# EAGLE schematic mydpi (EAGLE 9.5.2)
CHECKED_BY: -; DRAWN_BY: zaan; REV: 1.0; TITLE: myDPI
Assembly variants: BOM
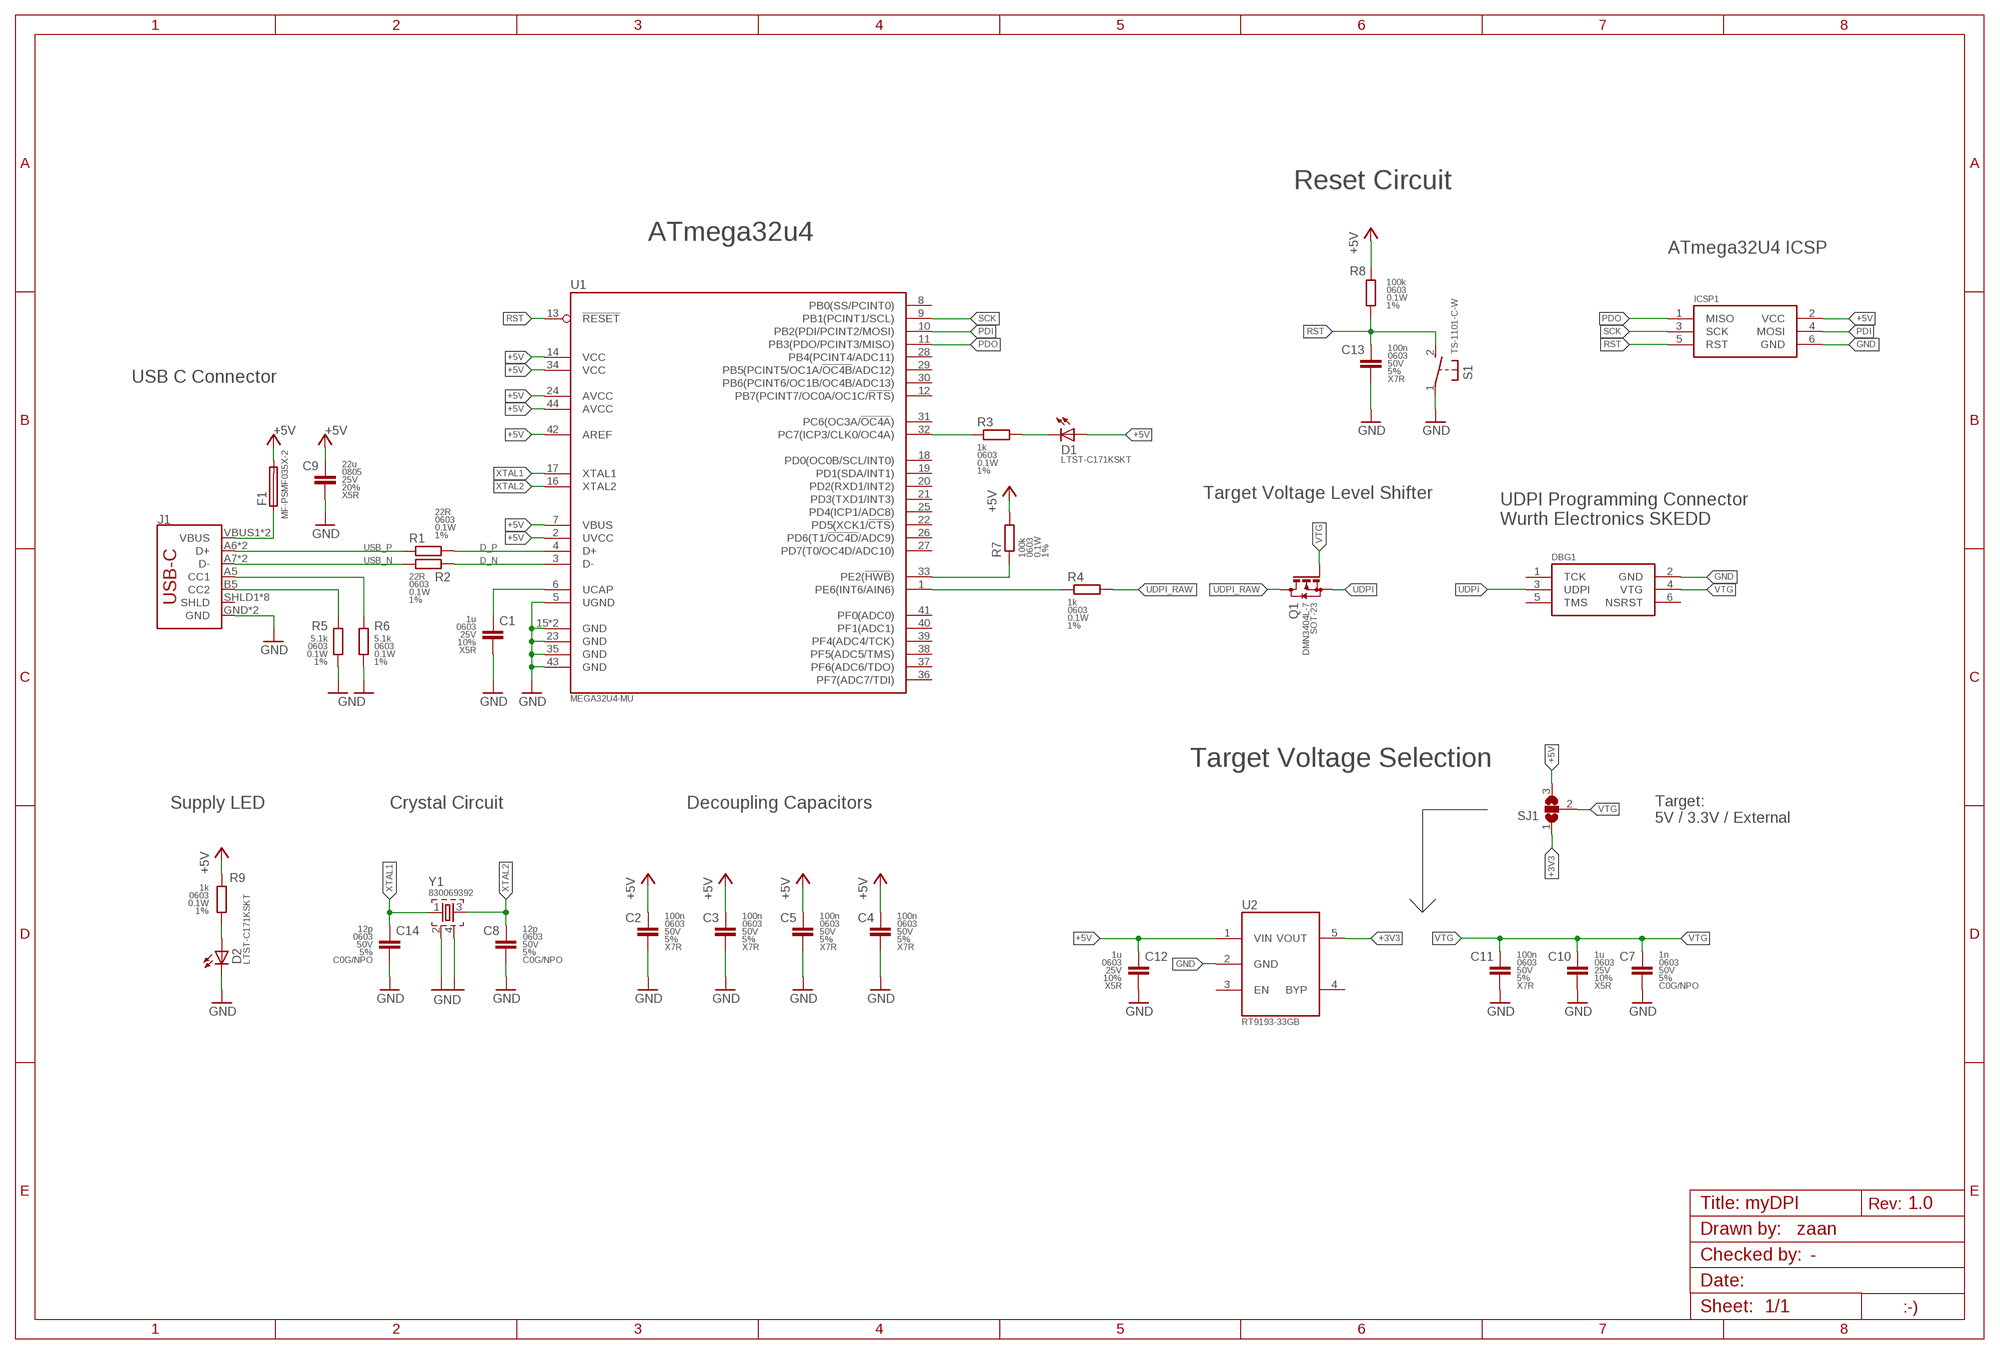
[diagram p0: schematic, sheet 1]

## Parts
C1  1u  1UF-0603-25V-10%  [C0603]
C2  100n  100NF-0603-50V-5%  [C0603]
C3  100n  100NF-0603-50V-5%  [C0603]
C4  100n  100NF-0603-50V-5%  [C0603]
C5  100n  100NF-0603-50V-5%  [C0603]
C7  1n  1NF-0603-50V-5%  [C0603]
C8  12p  12PF-0603-50V-5%  [C0603]
C9  22u  22UF-0805-25V-20%  [C0805]
C10  1u  1UF-0603-25V-10%  [C0603]
C11  100n  100NF-0603-50V-5%  [C0603]
C12  1u  1UF-0603-25V-10%  [C0603]
C13  100n  100NF-0603-50V-5%  [C0603]
C14  12p  12PF-0603-50V-5%  [C0603]
D1  LTST-C171KSKT  [CHIPLED_0805]
D2  LTST-C171KSKT  [CHIPLED_0805]
DBG1  AVR-UPDI-6-SKEDD  [490107670612_DEBUGGING]  (not fitted in variant BOM)
F1  MF-PSMF035X-2  [F0805]
ICSP1  AVR-ISP-SMD  [AVRISP-1.27-SMD]  (not fitted in variant BOM)
J1  USB_C2-LAYER  [USB-C-16P]
Q1  DMN3404L  [SOT23]
R1  22R  22OHM-0603-1/10W-1%  [R0603]
R2  22R  22OHM-0603-1/10W-1%  [R0603]
R3  1k  1KOHM-0603-1/10W-1%  [R0603]
R4  1k  1KOHM-0603-1/10W-1%  [R0603]
R5  5.1k  5.1KOHM-0603-1/10W-1%  [R0603]
R6  5.1k  5.1KOHM-0603-1/10W-1%  [R0603]
R7  100k  100KOHM-0603-1/10W-1%  [R0603]
R8  100k  100KOHM-0603-1/10W-1%  [R0603]
R9  1k  1KOHM-0603-1/10W-1%  [R0603]
S1  TS-1101-C-W  [SPST-6X3.6]
SJ1  SJ2W  [SJ_2]  (not fitted in variant BOM)
U1  MEGA32U4-MU  [TQFN44_7MM]
U2  RT9193-33GB  [SOT23-5]
Y1  830069392  [WE-XTAL_CFPX-218]

## Nets
+3V3: SJ1.1 U2.5(VOUT)
+5V: C2.1 C3.1 C4.1 C5.1 C9.1 C12.1 D1.A F1.2 ICSP1.2(VCC) R7.2 R8.2 R9.1 SJ1.3 U1.2(UVCC) U1.7(VBUS) U1.14(VCC) U1.24(AVCC) U1.34(VCC) U1.42(AREF) U1.44(AVCC) U2.1(VIN)
D_N [usb]: R2.2 U1.3(D-)
D_P [usb]: R1.2 U1.4(D+)
GND: C1.2 C2.2 C3.2 C4.2 C5.2 C7.2 C8.2 C9.2 C10.2 C11.2 C12.2 C13.2 C14.2 D2.C DBG1.2(GND) ICSP1.6(GND) J1.GND J1.GND2(GND) R5.1 R6.1 S1.1(P) U1.5(UGND) U1.15(GND) U1.23(GND) U1.35(GND) U1.43(GND) U1.EXP(GND) U2.2(GND) Y1.2 Y1.4
N$1: R3.1 U1.32(PC7(ICP3/CLK0/OC4A))
N$2: D1.C R3.2
N$5: J1.B5(CC2) R5.2
N$6: J1.A5(CC1) R6.2
N$7: R7.1 U1.33(PE2(!HWB!))
N$8: C1.1 U1.6(UCAP)
N$9: D2.A R9.2
N$12: F1.1 J1.VBUS1(VBUS) J1.VBUS2(VBUS)
PDI: ICSP1.4(MOSI) U1.10(PB2(PDI/PCINT2/MOSI))
PDO: ICSP1.1(MISO) U1.11(PB3(PDO/PCINT3/MISO))
PE6: R4.1 U1.1(PE6(INT6/AIN6))
RST: C13.1 ICSP1.5(RST) R8.1 S1.2(S) U1.13(!RESET!)
SCK: ICSP1.3(SCK) U1.9(PB1(PCINT1/SCL))
UDPI: DBG1.3(UDPI) Q1.2(S)
UDPI_RAW: Q1.3(D) R4.2
USB_N [usb]: J1.A7(D-) J1.B7(D-) R2.1
USB_P [usb]: J1.A6(D+) J1.B6(D+) R1.1
VTG: C7.1 C10.1 C11.1 DBG1.4(VTG) Q1.1(G) SJ1.2
XTAL1: C14.1 U1.17(XTAL1) Y1.1
XTAL2: C8.1 U1.16(XTAL2) Y1.3
Unconnected: DBG1.1(TCK) DBG1.5(TMS) DBG1.6(NSRST) J1.SHLD1(SHLD) J1.SHLD2(SHLD) J1.SHLD3(SHLD) J1.SHLD4(SHLD) J1.SHLD5(SHLD) J1.SHLD6(SHLD) J1.SHLD7(SHLD) J1.SHLD8(SHLD) U1.8(PB0(SS/PCINT0)) U1.12(PB7(PCINT7/OC0A/OC1C/!RTS!)) U1.18(PD0(OC0B/SCL/INT0)) U1.19(PD1(SDA/INT1)) U1.20(PD2(RXD1/INT2)) U1.21(PD3(TXD1/INT3)) U1.22(PD5(XCK1/!CTS!)) U1.25(PD4(ICP1/ADC8)) U1.26(PD6(T1/!OC4D!/ADC9)) U1.27(PD7(T0/OC4D/ADC10)) U1.28(PB4(PCINT4/ADC11)) U1.29(PB5(PCINT5/OC1A/!OC4B!/ADC12)) U1.30(PB6(PCINT6/OC1B/OC4B/ADC13)) U1.31(PC6(OC3A/!OC4A!)) U1.36(PF7(ADC7/TDI)) U1.37(PF6(ADC6/TDO)) U1.38(PF5(ADC5/TMS)) U1.39(PF4(ADC4/TCK)) U1.40(PF1(ADC1)) U1.41(PF0(ADC0)) U2.3(EN) U2.4(BYP)

## Notes on the sheet
- Reset Circuit
- ATmega32u4
- ATmega32U4 ICSP
- USB C Connector
- Target Voltage Level Shifter
- UDPI Programming Connector
  Wurth Electronics SKEDD
- Target Voltage Selection
- Supply LED | Crystal Circuit | Decoupling Capacitors
- Target:
  5V / 3.3V / External

## Library data of the parts
C1 C10 C12 = zaan-Capacitors:1UF: 1uF capacitor; DESCRIPTION: Surface Mount Capacitor; DIELECTRIC: X5R; MF: Yageo; MPN: CC0603KRX5R8BB105; PACKAGE: 1606; PACKAGE-IN: 0603; TOLERANCE: 10%; VOLTAGE: 25V
C2-C5 C11 C13 = zaan-Capacitors:100NF: 100nF capacitor; DESCRIPTION: Surface Mount Capacitor; DIELECTRIC: X7R; MF: Yageo; MPN: CC0603JRX7R9BB104; PACKAGE: 1606; PACKAGE-IN: 0603; TOLERANCE: 5%; VOLTAGE: 50V
C7 = zaan-Capacitors:1NF: 1nF capacitor; DESCRIPTION: Surface Mount Capacitor; DIELECTRIC: C0G/NPO; MF: Yageo; MPN: CC0603JRNPO9BN102; PACKAGE: 1608; PACKAGE-IN: 0603; TOLERANCE: 5%; VOLTAGE: 50V
C8 C14 = zaan-Capacitors:12PF: 12pF capacitor; DESCRIPTION: Surface Mount Capacitor; DIELECTRIC: C0G/NPO; MF: Yageo; MPN: CC0603JRNPO9BN120; PACKAGE: 1606; PACKAGE-IN: 0603; TOLERANCE: 5%; VOLTAGE: 50V
C9 = zaan-Capacitors:22UF: 22uF capacitor; DESCRIPTION: Surface Mount Capacitor; DIELECTRIC: X5R; MF: Murata; MPN: GRM21BR61E226ME44L; PACKAGE: 2012; PACKAGE-IN: 0805; TOLERANCE: 20%; VOLTAGE: 25V
D1 D2 = zaan-Optoelectronics:LTST: SMD LED Footprint: 0805 Source: Datasheet <http://optoelectronics.liteon.com/upload/download/ds22-2000-110/ltst-c171kskt.pdf> Manufacturer: Lite-On; DESCRIPTION: Surface Mount LED; MF: Lite-On; MPN: LTST-C171KSKT; PACKAGE: 2012; PACKAGE-IN: 0805
DBG1 = zaan-Connectors:AVR-UPDI-6
F1 = zaan-Fuses:MF-PSMF: PTC Resetable Fuse MF-PSMF Series - PTC Resettable Fuses Footprint: 0805 Source: Datasheet <https://www.bourns.com/data/global/pdfs/mfpsmf.pdf> Manufacturer: Bourns; DESCRIPTION: PTC Fuse; MF: Bourns; MPN: MF-PSMF035X-2; PACKAGE: 2012
ICSP1 = zaan-Connectors:AVR-ISP
J1 = zaan-Connectors:USB_C: USB Type C 16 Pin Connector Female 16 Pin Connector Footprint: USB-C 16P Source: Datasheet <https://datasheet.lcsc.com/szlcsc/1811101520_Jing-Extension-of-the-Electronic-Co-C167321_C167321.pdf> Manufacturer: Jing Extension of the Electronic Co. Super Speed pins not available on the 16-pin purely SMD connector so this part is best for USB 2.0 implementations. D1 and D2 are tied together enabling D+/- no matter which way the cable is plugged into the connector. The two channel configuration pins (CC1/2) are exposed. These are normally connected to ground via 5.1k resistors but can be reconfigured for high current/high power applications.; DESCRIPTION: USB Type C Female; MF: Jing Extension; MPN: C167321; PACKAGE: USB-C 16P
Q1 = zaan-Discrete:DMN3404L: N-CHANNEL MOS FET N-Channel Logic Level Enhancement Mode Field Effect Transistor Footprint: SOT-23 Source: Datasheet <https://www.diodes.com/assets/Datasheets/ds31787.pdf> Manufacturer: Diodes Incorporated; DESCRIPTION: N-CHANNEL MOSFET; MF: Diodes Incorporated; MPN: DMN3404L-7; PACKAGE: SOT-23
R1 R2 = zaan-Resistors:22OHM: 22Ω resistor; DESCRIPTION: Surface Mount Resistor; MF: Yageo; MPN: RC0603FR-0722RL; PACKAGE: 1608; PACKAGE-IN: 0603; POWER: 0.1W; TOLERANCE: 1%; VOLTAGE: 75V
R3 R4 R9 = zaan-Resistors:1KOHM: 1kΩ resistor; DESCRIPTION: Surface Mount Resistor; MF: Yageo; MPN: RC0603FR-071KL; PACKAGE: 1608; PACKAGE-IN: 0603; POWER: 0.1W; TOLERANCE: 1%; VOLTAGE: 75V
R5 R6 = zaan-Resistors:5.1KOHM: 5.1kΩ resistor; DESCRIPTION: Surface Mount Resistor; MF: Yageo; MPN: RC0603FR-075K1L; PACKAGE: 1608; PACKAGE-IN: 0603; POWER: 0.1W; TOLERANCE: 1%; VOLTAGE: 75V
R7 R8 = zaan-Resistors:100KOHM: 100kΩ resistor; DESCRIPTION: Surface Mount Resistor; MF: Yageo; MPN: RC0603FR-07100KL; PACKAGE: 1608; PACKAGE-IN: 0603; POWER: 0.1W; TOLERANCE: 1%; VOLTAGE: 75V
S1 = zaan-Electromechanical:TS-1101-C: Tactile Button SPST Footprint: 6.1X3.6X2.5 Source: Datasheet <https://datasheet.lcsc.com/szlcsc/1811082126_Korean-Hroparts-Elec-K2-1107ST-A4SW-06_C118141.pdf> Manufacturer: ON Semiconductor; DESCRIPTION: Tactile Button; MF: Korean Hroparts Elec; MPN: K2-1107ST-A4SW-06; PACKAGE: 6.1X3.6X2.5
SJ1 = jumper:SJ2W: SMD solder JUMPER
U1 = zaan-IC-Microcontroller:MEGA32U4: ATmega32u4 8-bit Microcontroller with 16/32K bytes of ISP Flash and USB Controller Footprint: QFN-44 Source: Datasheet <http://ww1.microchip.com/downloads/en/devicedoc/atmel-7766-8-bit-avr-atmega16u4-32u4_datasheet.pdf> Manufacturer: Atmel; DESCRIPTION: Microcontroller; MF: Atmel; MPN: ATMEGA32U4-MU; PACKAGE: QFN-44
U2 = zaan-IC-Power:RT9193: LDO Regulator 300mA, Ultra-Low Noise, Ultra-Fast CMOS LDO Regulator Footprint: SOT-23-5 Source: Datasheet <https://www.richtek.com/assets/product_file/RT9193/DS9193-16.pdf> Manufacturer: Richtek; DESCRIPTION: Low Dropout Regulator; MF: Richtek; MPN: RT9193-33GB; PACKAGE: SOT-23-5
Y1 = zaan-Electromechanical:830069: Crystal SMD Crystal Footprint: 2520 Source: Datasheet <https://www.we-online.de/katalog/de/WE-XTAL/> Manufacturer: Wurth Electronics; DESCRIPTION: Crystal; MF: Wurth Electronics; MPN: 830069392; PACKAGE: 2520

## Net classes
0 default: width 0.254 mm, drill 0.3 mm
1 usb: width 0.254 mm, drill 0.3 mm, clearance 0.2 mm